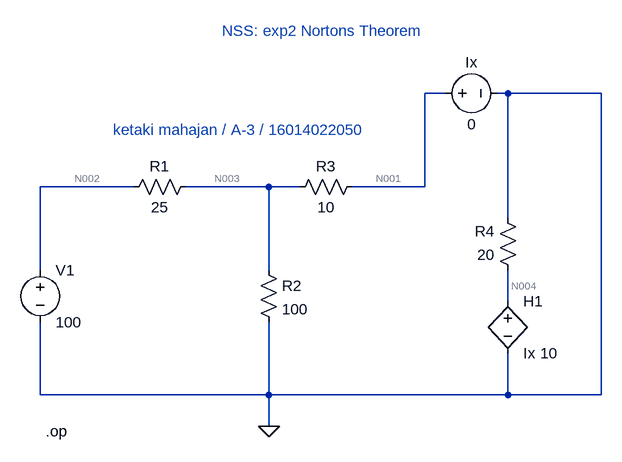
[diagram p0: schematic exp2_nor_16014022050.asc]
exp2_nor_16014022050.asc, the LTspice schematic file:
Version 4
SHEET 1 880 680
WIRE 352 -96 320 -96
WIRE 448 -96 432 -96
WIRE 592 -96 448 -96
WIRE -128 48 -272 48
WIRE 80 48 -48 48
WIRE 128 48 80 48
WIRE 320 48 320 -96
WIRE 320 48 208 48
WIRE 448 96 448 -96
WIRE -272 176 -272 48
WIRE 80 176 80 48
WIRE 448 224 448 176
WIRE -272 368 -272 256
WIRE 80 368 80 256
WIRE 80 368 -272 368
WIRE 448 368 448 304
WIRE 448 368 80 368
WIRE 592 368 592 -96
WIRE 592 368 448 368
WIRE 80 416 80 368
FLAG 80 416 0
SYMBOL voltage -272 160 R0
WINDOW 123 0 0 Left 0
WINDOW 39 0 0 Left 0
SYMATTR InstName V1
SYMATTR Value 100
SYMBOL res -144 64 R270
WINDOW 0 32 56 VTop 2
WINDOW 3 0 56 VBottom 2
SYMATTR InstName R1
SYMATTR Value 25
SYMBOL res 64 160 R0
SYMATTR InstName R2
SYMATTR Value 100
SYMBOL res 224 32 R90
WINDOW 0 0 56 VBottom 2
WINDOW 3 32 56 VTop 2
SYMATTR InstName R3
SYMATTR Value 10
SYMBOL res 464 192 R180
WINDOW 0 36 76 Left 2
WINDOW 3 36 40 Left 2
SYMATTR InstName R4
SYMATTR Value 20
SYMBOL h 448 208 R0
SYMATTR InstName H1
SYMATTR Value Ix 10
SYMBOL voltage 336 -96 R270
WINDOW 0 32 56 VTop 2
WINDOW 3 -32 56 VBottom 2
SYMATTR InstName Ix
SYMATTR Value 0
TEXT -264 424 Left 2 !.op
TEXT -160 -40 Left 2 ;ketaki mahajan / A-3 / 16014022050
TEXT 8 -192 Left 2 ;NSS: exp2 Nortons Theorem

The netlist it stands for:
* exp2_nor_16014022050.asc
V1 N002 0 100
R1 N002 N003 25
R2 N003 0 100
R3 N001 N003 10
R4 N004 0 20
H1 N004 0 Ix 10
V§Ix N001 0 0
.op
* ketaki mahajan / A-3 / 16014022050
* NSS: exp2 Nortons Theorem
.backanno
.end

* Results of the author's LTspice run, read from the files saved beside the schematic
* Operating Point:
*   V(n002) = 100 V
*   V(n003) = 26.67 V
*   V(n001) = 0 V
*   V(n004) = 26.67 V
*   I(H1) = -1.333 A
*   I(R1) = 2.933 A
*   I(R2) = 266.7 mA
*   I(R3) = -2.667 A
*   I(R4) = 1.333 A
*   I(V1) = -2.933 A
*   I(Ix) = 2.667 A